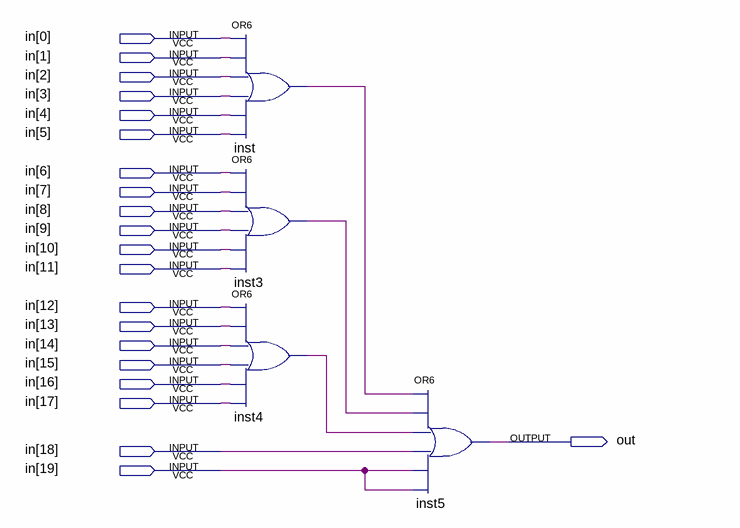
[diagram p0: schematic sheet]
// Quartus schematic myOr20.bdf as structural Verilog: 4 symbols, 21 pins
module myOr20 (
  input  [19:0] in,
  output out
);

  wire inst3_out, inst4_out, inst_out;

  or inst (inst_out, in[0], in[1], in[2], in[3], in[4], in[5]);
  or inst3 (inst3_out, in[6], in[7], in[8], in[9], in[10], in[11]);
  or inst4 (inst4_out, in[12], in[13], in[14], in[15], in[16], in[17]);
  or inst5 (out, inst_out, inst3_out, inst4_out, in[18], in[19], in[19]);
endmodule
